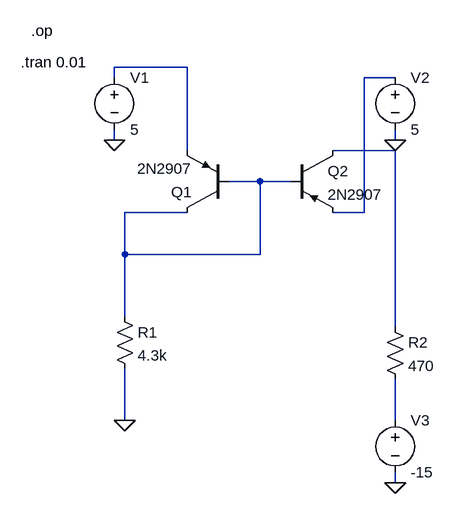
[diagram p0: schematic Current Mirror.asc]
Current Mirror.asc, the LTspice schematic file:
Version 4
SHEET 1 880 832
WIRE 256 176 144 176
WIRE 144 192 144 176
WIRE 576 192 528 192
WIRE 144 288 144 272
WIRE 576 288 576 272
WIRE 256 304 256 176
WIRE 576 304 480 304
WIRE 368 352 320 352
WIRE 416 352 368 352
WIRE 256 400 160 400
WIRE 528 400 528 192
WIRE 528 400 480 400
WIRE 160 464 160 400
WIRE 368 464 368 352
WIRE 368 464 160 464
WIRE 160 560 160 464
WIRE 576 576 576 304
WIRE 160 720 160 640
WIRE 576 720 576 656
WIRE 576 816 576 800
FLAG 144 288 0
FLAG 576 288 0
FLAG 160 720 0
FLAG 576 816 0
SYMBOL voltage 144 176 R0
SYMATTR InstName V1
SYMATTR Value 5
SYMBOL voltage 576 176 R0
SYMATTR InstName V2
SYMATTR Value 5
SYMBOL pnp 320 400 R180
SYMATTR InstName Q1
SYMATTR Value 2N2907
SYMBOL pnp 416 304 R0
SYMATTR InstName Q2
SYMATTR Value 2N2907
SYMBOL res 144 544 R0
SYMATTR InstName R1
SYMATTR Value 4.3k
SYMBOL res 560 560 R0
SYMATTR InstName R2
SYMATTR Value 470
SYMBOL voltage 576 704 R0
SYMATTR InstName V3
SYMATTR Value -15
TEXT 16 120 Left 2 !.op
TEXT 0 168 Left 2 !.tran 0.01

The netlist it stands for:
* Current Mirror.asc
V1 N001 0 5
V2 N002 0 5
Q1 N004 N004 N001 0 2N2907
Q2 N003 N004 N002 0 2N2907
R1 N004 0 4.3k
R2 N003 N005 470
V3 N005 0 -15
.model NPN NPN
.model PNP PNP
.lib standard.bjt
.op
.tran 0.01
.backanno
.end